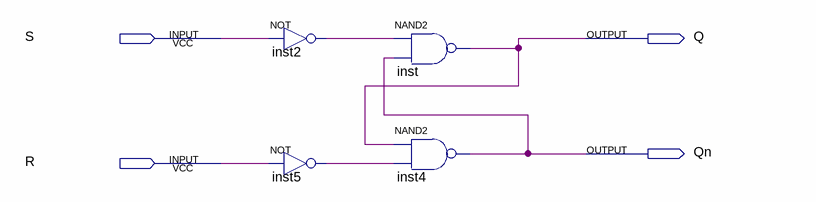
[diagram p0: schematic sheet]
// Quartus schematic lab9step1.bdf as structural Verilog: 4 symbols, 4 pins
module lab9step1 (
  input  S,
  input  R,
  output Q,
  output Qn
);

  wire inst2_out, inst5_out;

  not inst2 (inst2_out, S);
  not inst5 (inst5_out, R);
  nand inst (Q, inst2_out, Qn);
  nand inst4 (Qn, Q, inst5_out);
endmodule
